# Altium project Teensy Crash EDR v3.PrjPcb
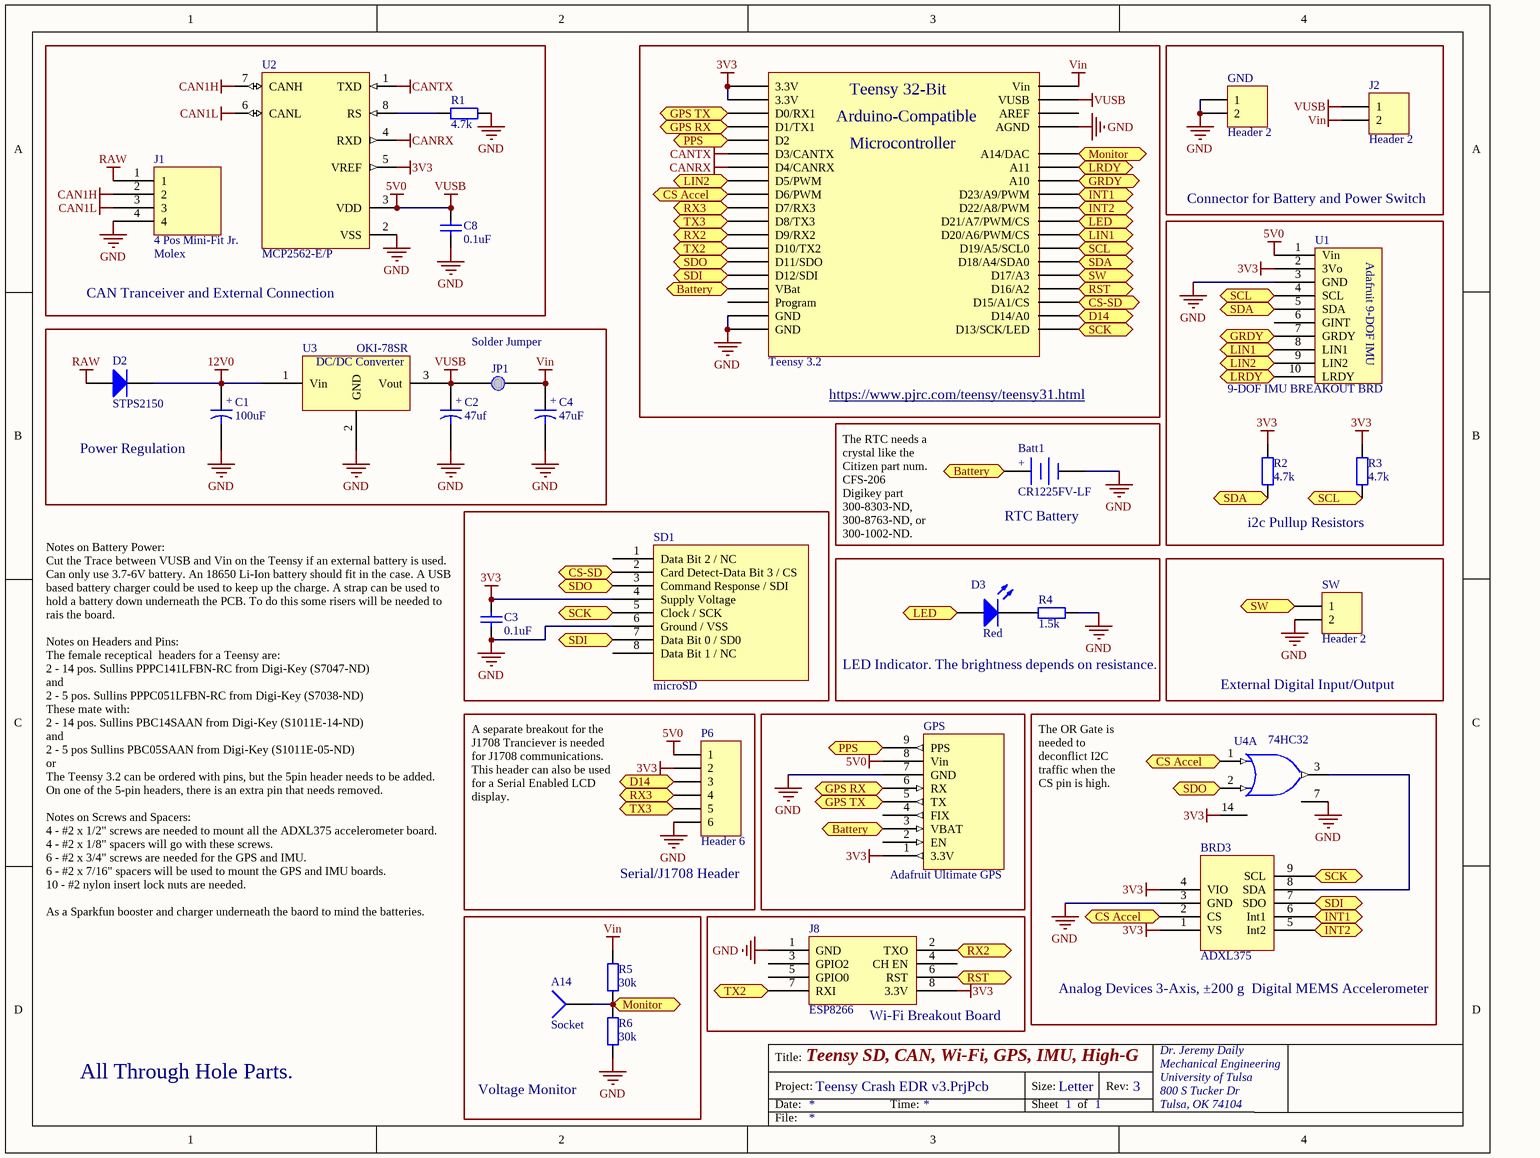
[diagram p0: Teensy with CAN SD GPS and IMU v3.SchDoc]
1 sheet, 30 parts. Net scope: flat (ports and power ports of the same name join across sheets).
Board file: Teensy Crash EDR v3 for Bud PN-1331 PCB Board.PcbDoc

## Sheet Teensy with CAN SD GPS and IMU v3.SchDoc: Teensy SD, CAN, Wi-Fi, GPS, IMU, High-G
size Letter; Author: Dr. Jeremy Daily; Organization: Mechanical Engineering; Address1: University of Tulsa; Address2: 800 S Tucker Dr; Address3: Tulsa, OK 74104; Revision: 3; SheetNumber: 1; SheetTotal: 1

### Parts
A14  Socket  [PIN1]
Batt1  CR1225FV-LF  [Coin Cell with Tabs]
BRD3  ADXL375  [ADXL375 Eval]
C1  100uF  [Elec. Cap 5 x 10mm]
C2  47uf  [Elec. Cap 5 x 10mm]
C3  0.1uF  [RAD-0.2]
C4  47uF  [Elec. Cap 5 x 10mm]
C8  0.1uF  [RAD-0.2]
D2  STPS2150  [DO-41]
D3  Red  [5mm Rad LED]
GND  Header 2  [HDR1X2]
GPS  Adafruit Ultimate GPS  [GPS]
J1  4 Pos Mini-Fit Jr.  Manufacturer: Molex  [4 POS Vertical MINI-FIT JR]
J2  Header 2  [HDR1X2]
J8  ESP8266  [ESP8266]
JP1  Solder Jumper  [Solder Jumper]
P6  Header 6  [HDR1X6]
R1  4.7k  [AXIAL-0.4]
R2  4.7k  [AXIAL-0.4]
R3  4.7k  [AXIAL-0.4]
R4  1.5k  [AXIAL-0.4]
R5  30k  [AXIAL-0.4]
R6  30k  [AXIAL-0.4]
SD1  microSD  [SD- Vertical]
SW  Header 2  [HDR1X2]
Teensy_3.2  Teensy 3.2  [Teensy]
U1  9-DOF IMU BREAKOUT BRD  [Adafruit 9-DOF IMU]
U2  MCP2562-E/P  [PDIP300-P8]
U3  OKI-78SR  [78xx]
U4  74HC32  [N14A]  (part A of 4)

### Blocks framed on the sheet
CAN Tranceiver and External Connection: C8 J1 R1 U2
https://www.pjrc.com/teensy/teensy31.html: Teensy_3.2
Connector for Battery and Power Switch: GND J2
i2c Pullup Resistors: R2 R3 U1
Power Regulation: C1 C2 C4 D2 JP1 U3
RTC Battery: Batt1
LED Indicator. The brightness depends on resistance.: D3 R4
External Digital Input/Output: SW
Serial/J1708 Header: P6
Analog Devices 3-Axis, ±200 g  Digital MEMS Accelerometer: BRD3 U4
Voltage Monitor: A14 R5 R6
Wi-Fi Breakout Board: J8

### Ports
Battery, CS Accel, CS-SD, D14, GPS RX, GPS TX, GRDY, INT1, INT2, LED, LIN1, LIN2, LRDY, Monitor, PPS, RST, RX2, RX3, SCK, SCL, SDA, SDI, SDO, SW, TX2, TX3

### Nets
3V3: BRD3.1(VS) BRD3.4(VIO) C3.2 GPS.1(3.3V) J8.8(3.3V) P6.2 R2.2 R3.2 SD1.4(Supply_Voltage) Teensy_3.2.16(3.3V) Teensy_3.2.31(3.3V) U1.2(3Vo) U2.5(VREF) U4.14(VCC)
5V0: C2.1 C8.2 GPS.8(Vin) J2.1 JP1.1 P6.1 Teensy_3.2.34(VUSB) U1.1(Vin) U2.3(VDD) U3.3(Vout)  [also labelled VUSB]
12V0: C1.1 D2.2(K) U3.1(Vin)
CAN1H: J1.2 U2.7(CANH)
CAN1L: J1.3 U2.6(CANL)
CANRX: Teensy_3.2.9(D4/CANRX) U2.4(RXD)
CANTX: Teensy_3.2.10(D3/CANTX) U2.1(TXD)
GND: Batt1.2(-) BRD3.3(GND) C1.2(-) C2.2(-) C3.1 C4.2(-) C8.1 GND.1 GND.2 GPS.7(GND) J1.4 J8.1(GND) P6.6 R1.1 R4.2 R6.1 SD1.6(Ground_/_VSS) SW.2 Teensy_3.2.14(GND) Teensy_3.2.17(GND) Teensy_3.2.32(AGND) U1.3(GND) U2.2(VSS) U3.2(GND) U4.7(GND)
RAW: D2.1(A) J1.1
Vin: C4.1 J2.2 JP1.2 R5.2 Teensy_3.2.33(Vin)
NetA14_1: A14.1 R5.1 R6.2 Teensy_3.2.19(A14/DAC) ; port Monitor
NetBatt1_1: Batt1.1(+) GPS.3(VBAT) Teensy_3.2.15(VBat) ; port Battery
NetBRD3_2: BRD3.2(CS) Teensy_3.2.7(D6/PWM) U4.1(A) ; port CS Accel
NetBRD3_5: BRD3.5(Int2) Teensy_3.2.29(D22/A8/PWM) ; port INT2
NetBRD3_6: BRD3.6(Int1) Teensy_3.2.30(D23/A9/PWM) ; port INT1
NetBRD3_7: BRD3.7(SDO) SD1.7(Data_Bit_0_/_SD0) Teensy_3.2.1(D12/SDI) ; port SDI
NetBRD3_8: BRD3.8(SDA) U4.3(O)
NetBRD3_9: BRD3.9(SCL) SD1.5(Clock_/_SCK) Teensy_3.2.20(D13/SCK/LED) ; port SCK
NetD3_1: D3.1(A) Teensy_3.2.28(D21/A7/PWM/CS) ; port LED
NetD3_2: D3.2(K) R4.1
NetGPS_5: GPS.5(TX) Teensy_3.2.13(D0/RX1) ; port GPS TX
NetGPS_6: GPS.6(RX) Teensy_3.2.12(D1/TX1) ; port GPS RX
NetGPS_9: GPS.9(PPS) Teensy_3.2.11(D2) ; port PPS
NetJ8_2: J8.2(TXO) Teensy_3.2.4(D9/RX2) ; port RX2
NetJ8_6: J8.6(RST) Teensy_3.2.23(D16/A2) ; port RST
NetJ8_7: J8.7(RXI) Teensy_3.2.3(D10/TX2) ; port TX2
NetP6_3: P6.3 Teensy_3.2.21(D14/A0) ; port D14
NetP6_4: P6.4 Teensy_3.2.6(D7/RX3) ; port RX3
NetP6_5: P6.5 Teensy_3.2.5(D8/TX3) ; port TX3
NetR1_2: R1.2 U2.8(RS)
NetR2_1: R2.1 Teensy_3.2.25(D18/A4/SDA0) U1.5(SDA) ; port SDA
NetR3_1: R3.1 Teensy_3.2.26(D19/A5/SCL0) U1.4(SCL) ; port SCL
NetSD1_2: SD1.2(Card_Detect-Data_Bit_3_/_CS) Teensy_3.2.22(D15/A1/CS) ; port CS-SD
NetSD1_3: SD1.3(Command_Response_/_SDI) Teensy_3.2.2(D11/SDO) U4.2(B) ; port SDO
NetSW_1: SW.1 Teensy_3.2.24(D17/A3) ; port SW
NetTeensy_3.2_8: Teensy_3.2.8(D5/PWM) U1.9(LIN2) ; port LIN2
NetTeensy_3.2_27: Teensy_3.2.27(D20/A6/PWM/CS) U1.8(LIN1) ; port LIN1
NetTeensy_3.2_36: Teensy_3.2.36(A10) U1.7(GRDY) ; port GRDY
NetTeensy_3.2_37: Teensy_3.2.37(A11) U1.10(LRDY) ; port LRDY

Not connected (* = marked no-connect by the designer): GPS 2(EN) 4(FIX); J8 3(GPIO2) 4(CH_EN) 5(GPIO0); SD1 1(Data_Bit_2_/_NC) 8(Data_Bit_1_/_NC); Teensy_3.2 18(Program) 35(AREF); U1 6(GINT)

### Notes on the sheet
- The RTC needs a crystal like the Citizen part num.
  CFS-206
  Digikey part
  300-8303-ND,
  300-8763-ND, or
  300-1002-ND.
- The OR Gate is needed to deconflict I2C traffic when the CS pin is high.
- A separate breakout for the J1708 Tranciever is needed for J1708 communications. This header can also be used for a Serial Enabled LCD display.
- (near C3) Notes on Battery Power:
  Cut the Trace between VUSB and Vin on the Teensy if an external battery is used. Can only use 3.7-6V battery. An 18650 Li-Ion battery should fit in the case. A USB based battery charger could be used to keep up the charge. A strap can be used to hold a battery down underneath the PCB. To do this some risers will be needed to rais the board.
  Notes on Headers and Pins:
  The female receptical  headers for a Teensy are:
  2 - 14 pos. Sullins PPPC141LFBN-RC from Digi-Key (S7047-ND)
  and
  2 - 5 pos. Sullins PPPC051LFBN-RC from Digi-Key (S7038-ND)
  These mate with:
  2 - 14 pos. Sullins PBC14SAAN from Digi-Key (S1011E-14-ND)
  and
  2 - 5 pos Sullins PBC05SAAN from Digi-Key (S1011E-05-ND)
  or
  The Teensy 3.2 can be ordered with pins, but the 5pin header needs to be added. On one of the 5-pin headers, there is an extra pin that needs removed.
  Notes on Screws and Spacers:
  4 - #2 x 1/2" screws are needed to mount all the ADXL375 accelerometer board.
  4 - #2 x 1/8" spacers will go with these screws.
  6 - #2 x 3/4" screws are needed for the GPS and IMU.
  6 - #2 x 7/16" spacers will be used to mount the GPS and IMU boards.
  10 - #2 nylon insert lock nuts are needed.
  As a Sparkfun booster and charger underneath the baord to mind the batteries.
- All Through Hole Parts.
- Title:
- Project:
- Date:
- Time:
- Sheet
- Size:
- Letter
- of
- Rev:
- File:
- (in symbol 7805) DC/DC Converter
- (in symbol Electrolytic Cap) +
- (in symbol Teensy) Teensy 32-Bit; Arduino-Compatible; Microcontroller

### Library data of the parts
Batt1 = CR2032 Battery Holder: Coin Cell Battery 3V 2-PIN VERT 48mAh 12.5 x 2.5mm; Manufacturer: Renata; Supplier 1: Mouser; Supplier Part Number 1: 614-CR1225FV-LF; PartNumber: CR1225FV-LF
BRD3 = ADXL375 Eval: Analog Devices  EVAL-ADXL375Z; Manufacturer: Analog Devices Inc.; PartNumber: EVAL-ADXL375Z; Supplier 1: Digi-Key; Supplier Part Number 1: EVAL-ADXL375Z-ND
C1 C2 C4 = Electrolytic Cap: CAP ALUM 100UF 20% 63V RADIAL; Manufacturer: Panasonic Electronic Components; PartNumber: EEU-FC1J101; Supplier 1: Digi-Key; Supplier Part Number 1: P10343-ND
C3 C8 = Cap: Multilayer Ceramic Capacitors MLCC - Leaded 50volts 0.1uF 10% X7R; Manufacturer: AVX; PartNumber: SR215C104KAA; Supplier 1: Mouser; Supplier Part Number 1: 581-SR215C104K
D2 = Diode 1N4003: Schottky Diodes & Rectifiers 2.0 Amp 150 Volt; Manufacturer: STMicroelectronics; PartNumber: STPS2150; Supplier 1: Mouser; Supplier Part Number 1: 511-STPS2150
D3 = LED - SMD: LED RED DIFFUSED 0805 SMD; Manufacturer: OSRAM Opto Semiconductors Inc.; PartNumber: LS R976-NR-1; Supplier 1: Digi-Key; Supplier Part Number 1: 475-1278-1-ND
GND J2 = Header 2: Header, 2-Pin; LatestRevisionDate: 17-Jul-2002; LatestRevisionNote: Re-released for DXP Platform.; Publisher: Altium Limited
GPS = GPS - Adafruit: Manufacturer: Adafruit Industries LLC; PartNumber: 746; Supplier 1: Digi-Key; Supplier Part Number 1: 1528-1153-ND
J1 = 4 Pos Header Vert: CONN HEADER 4POS 4.2MM VERT TIN; PartNumber: 0039299042; Supplier 1: Digi-Key; Supplier 2: Mouser; Supplier Part Number 1: WM7325-ND; Supplier Part Number 2: 538-39-29-9040
J8 = ESP8266: Sparkfun ESP8266 Module (WRL-13678); Supplier 1: Digi-Key; Supplier Part Number 1: 1568-1235-ND; Manufacturer: Sparkfun; PartNumber: WRL-13678
P6 = Header 6: Header, 6-Pin; Manufacturer: Wurth Electronics; PartNumber: 61303211121; Supplier 1: Mouser; Supplier Part Number 1: 710-61303211121
R1-R6 = Res2: RES 4.7K OHM 1/4W 5% CARBON FILM; Manufacturer: Stackpole Electronics Inc.; PartNumber: CF14JT4K70; Supplier 1: Digi-Key; Supplier Part Number 1: CF14JT4K70TR-ND
SD1 = SD Card Holder Vertical: Memory Card Connectors MicroSD Card Conn Ver Dip Mnt Manual; Manufacturer: Yamaichi Electronics; PartNumber: PJS008U-3000-0; Supplier 1: Mouser; Supplier Part Number 1: 945-PJS008U-3000-0
SW = Header 2: Header, 2-Pin; Manufacturer: Wurth Electronics; PartNumber: 61303211121; Supplier 1: Mouser; Supplier Part Number 1: 710-61303211121
Teensy_3.2 = Teensy: 32 Bit Arduino-Compatible Microcontroller; Manufacturer: Sparkfun; PartNumber: DEV-13736; Supplier 1: Digi-Key; Supplier Part Number 1: 1568-1231-ND
U1 = Adafruit 9-DOF IMU: Adafruit 9-DOF IMU Breakout - L3GD20H + LSM303 PRODUCT ID: 1714; Manufacturer: Adafruit Industries LLC; PartNumber: 1714; Supplier 1: Digi-Key; Supplier Part Number 1: 1528-1029-ND
U2 = MCP2551-E/P: High-Speed CAN Transceiver, 8-Pin PDIP, Extended Temperature; Manufacturer: Microchip; Supplier 1: Digi-Key; Supplier Part Number 1: MCP2562-E/P-ND; Supplier 2: Farnell; Supplier Part Number 2: 1439745; PartNumber: MCP2562-E/P
U3 = 7805: 5V DC/DC Converter (7805 replacement); Manufacturer: Murata Power Solutions Inc.; PartNumber: OKI-78SR-5/1.5-W36-C; Supplier 1: Digi-Key; Supplier 2: Digi-Key; Supplier Part Number 1: 811-2196-5-ND; Supplier Part Number 2: 811-2692-ND
U4 = 74ACT32PC: Quad 2-Input OR Gate, 14-Pin PDIP, Commercial Grade; Manufacturer: Texas Instruments; PartNumber: SN74HC32N; Supplier 1: Mouser; Supplier Part Number 1: 595-SN74HC32N
A14 = Socket: LatestRevisionDate: 17-Jul-2002; LatestRevisionNote: Re-released for DXP Platform.; Publisher: Altium Limited
JP1 = Solder Jumper: Supplier 1: Digi-Key